# EAGLE design MusicalChristmasTree (EAGLE 7.5.0)
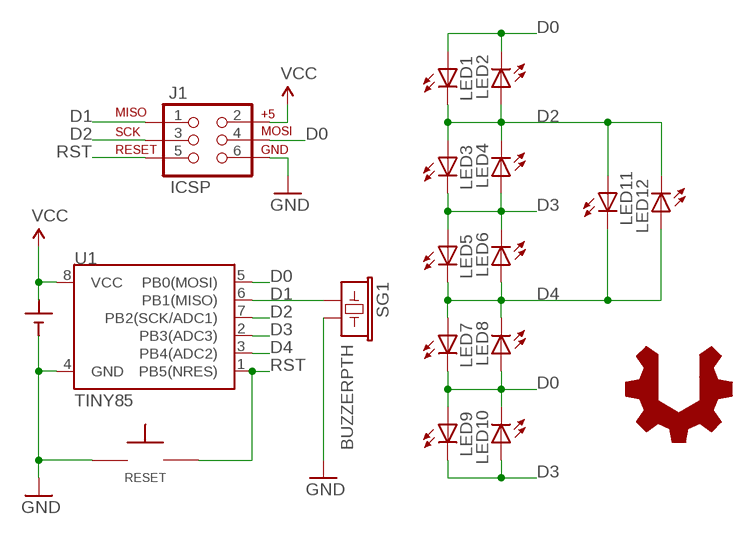
[diagram p0: schematic, sheet 1]

## Parts
BATT  CR2032  BATTCR2032_THRU  [CR2032-THRU]
J1  ICSP  AVR_SPI_PRG_6LABELED  [2X3-NS]
LED1  LED5MM  [LED5MM]
LED2  LED5MM  [LED5MM]
LED3  LED5MM  [LED5MM]
LED4  LED5MM  [LED5MM]
LED5  LED5MM  [LED5MM]
LED6  LED5MM  [LED5MM]
LED7  LED5MM  [LED5MM]
LED8  LED5MM  [LED5MM]
LED9  LED5MM  [LED5MM]
LED10  LED5MM  [LED5MM]
LED11  LED5MM  [LED5MM]
LED12  LED5MM  [LED5MM]
RESET  TAC_SPST_NO  [TAC_SPST_NO]
SG1  BUZZERPTH  [BUZZER-12MM]
U1  TINY85  ATTINY45TINY85-20-DIP  [DIP08]
U$1  USER_HACKABLE  [USER_HACKABLE]

## Nets
D0: J1.4(MOSI) LED1.A LED2.K(C) LED7.K(C) LED8.A LED9.A LED10.K(C) U1.5(PB0(MOSI))
D1: J1.1(MISO) SG1.+ U1.6(PB1(MISO))
D2: J1.3(SCK) LED1.K(C) LED2.A LED3.A LED4.K(C) LED11.A LED12.K(C) U1.7(PB2(SCK/ADC1))
D3: LED3.K(C) LED4.A LED5.A LED6.K(C) LED9.K(C) LED10.A U1.2(PB3(ADC3))
D4: LED5.K(C) LED6.A LED7.A LED8.K(C) LED11.K(C) LED12.A U1.3(PB4(ADC2))
GND: BATT.- J1.6(GND) RESET.P$1 SG1.- U1.4(GND)
RST: J1.5(RST) RESET.P$2 U1.1(PB5(NRES))
VCC: BATT.+1(+) J1.2(V+) U1.8(VCC)

## Library data of the parts
BATT = battery:BATT
J1 = barbary_enterprises:AVR_SPI_PRG_6: AVR ISP 6 Pin This is the reduced ISP connector for AVR programming. Common on Arduino. This footprint will take up less PCB space and can be used with a 10-pin to 6-pin adapter such as SKU: BOB-08508
LED1-LED12 = barbary_enterprises:LED: LEDs Standard schematic elements and footprints for 5mm, 3mm, 1206, and 0603 sized LEDs. 5mm - Spark Fun Electronics SKU : COM-00529 (and others)
RESET = barbary_enterprises:TAC_SPST_NO: 3,5 mm Tact Switches C&K PTS635 Series * Digi-Key Part Number: CKN9102-ND
SG1 = SparkFun-Electromechanical:BUZZER: Buzzer 12mm Spark Fun Electronics SKU : Comp-Buzzer
U1 = SparkFun-DigitalIC:ATTINY45: Atmel 8-pin 2/4/8kB flash uC; PROD_ID: IC-09445; VALUE: TINY85-20-DIP
U$1 = logo:USER_HACKABLE

## Board
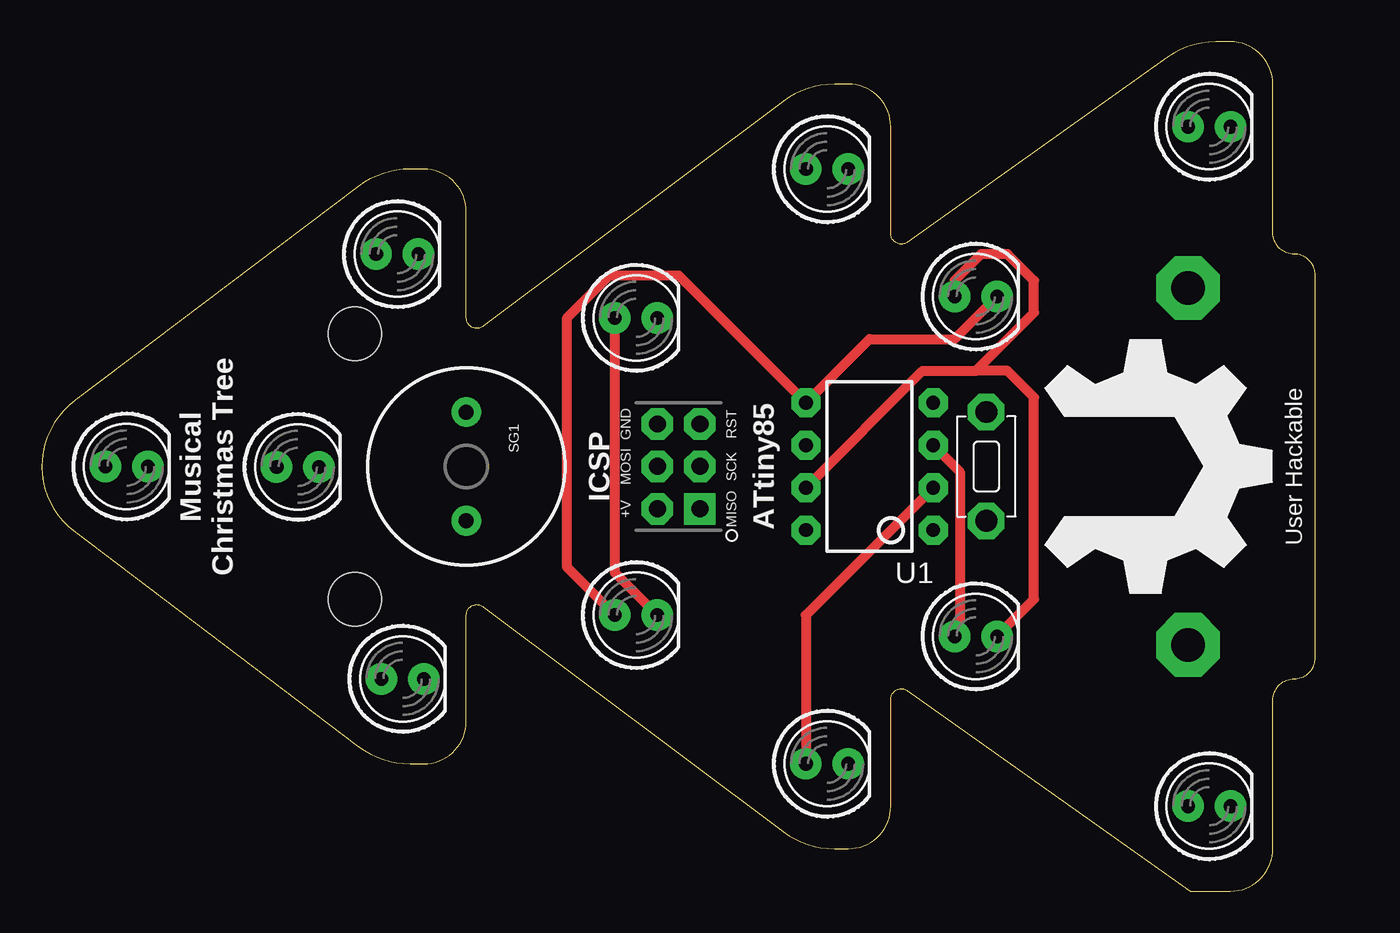
[diagram p1: board, top side]
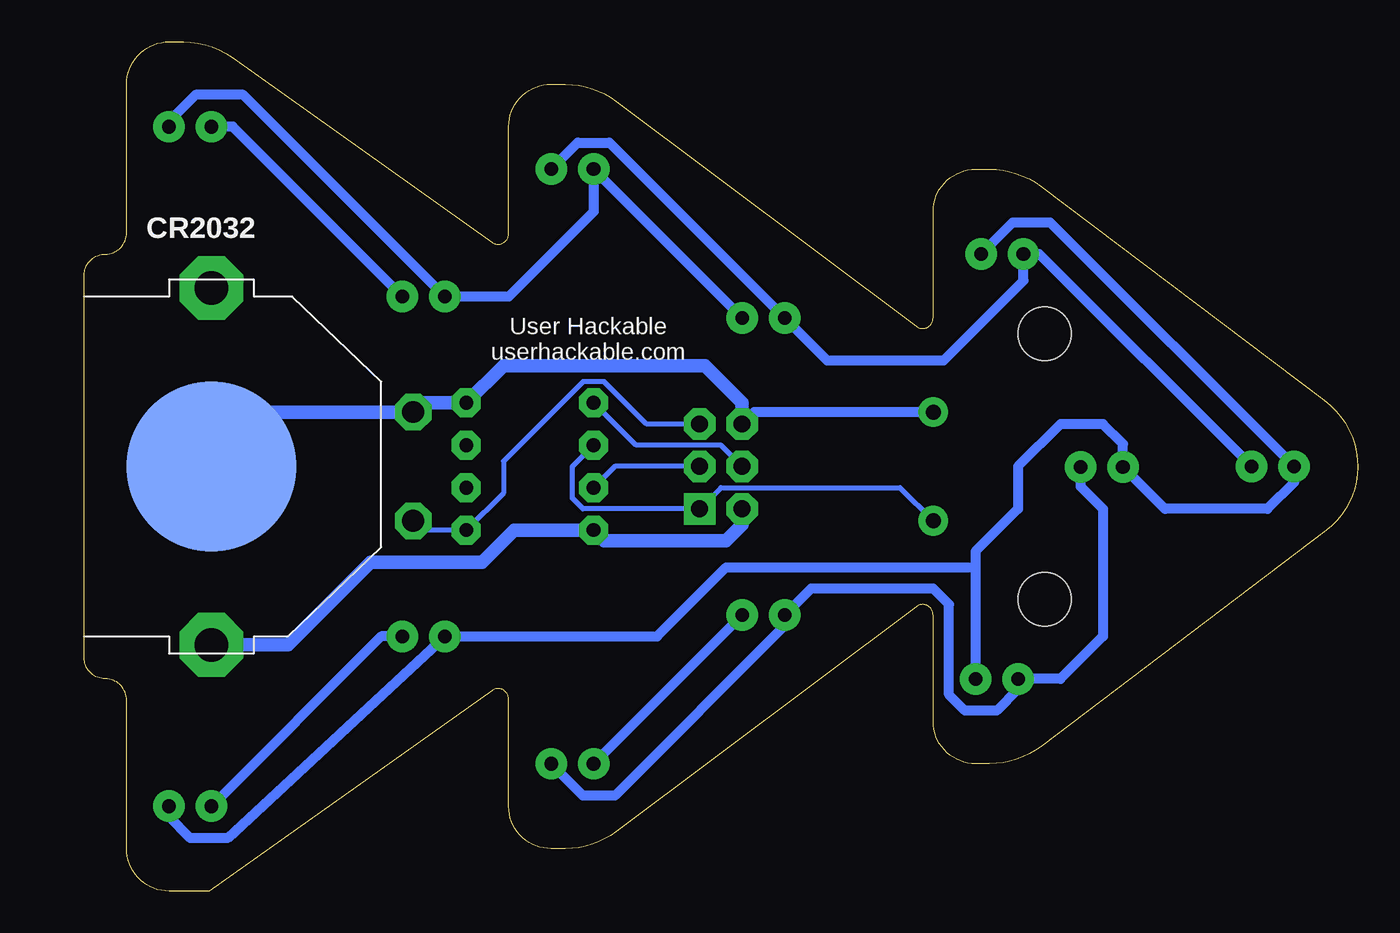
[diagram p2: board, bottom side, seen from below]

Size 76.2 x 50.8 mm. Coordinates in mm from the lower left corner, seen from the top.
Outline: 18.96,42.16 1.99,29.36 arc53 0,25.37 arc53 1.89,21.57 18.96,8.65 arc37 22.03,7.62 22.86,7.62 arc90 25.4,10.16 25.4,16.51 arc-127 26.42,17.02 44.37,3.56 arc37 47.41,2.54 48.26,2.54 arc90 50.8,5.08 50.8,11.47 arc-125 51.8,11.99 68.72,0 71.12,0 arc90 73.66,2.54 73.66,11.43 arc-90 74.93,12.7 arc90 76.2,13.97 76.2,36.83 arc90 74.93,38.1 arc-90 73.66,39.37 73.66,48.26 arc90 71.12,50.8 70.26,50.8 arc35 67.36,49.88 51.8,38.81 arc-125 50.8,39.33 50.8,45.72 arc90 48.26,48.26 47.41,48.26 arc37 44.37,47.24 26.42,33.78 arc-127 25.4,34.29 25.4,40.64 arc90 22.86,43.18 22.02,43.18 arc37 18.96,42.16
Copper layers (1*16): Top 0.0356mm / dielectric 1.5011mm / Bottom 0.0356mm
Design rules "LaenPCBOrder": minimum track width 6mil, minimum drill 13mil, track to track 6mil, track to pad 6mil, pad to pad 6mil, via to via 6mil, smd to smd 6mil, copper to edge 15mil, drill to drill 6mil, minimum pad ring 7mil, minimum via ring 7mil, stop-mask expansion 3mil, vias tented up to drill 0mil, thermal gap 10mil
Holes 3.17 mm at 18.73,33.34 18.73,17.46

### Footprints (pad centres in the part's own frame; a part is rotated, then mirrored left to right if it is on the bottom)
CR2032-THRU = drill 2 pad 3.81 octagon: +1 -10.668,0; +2 10.668,0 | smd 10.16 x 10.16: - 0,0
2X3-NS = drill 1.016 pad 1.88 square: 1 -2.54,-1.27 | drill 1.016 pad 1.88 octagon: 2 -2.54,1.27; 3 0,-1.27; 4 0,1.27; 5 2.54,-1.27; 6 2.54,1.27
LED5MM = drill 0.813 pad 1.88: A -1.27,0; K 1.27,0
TAC_SPST_NO = drill 1.3 pad 2.184 octagon: P$1 -3.251,0; P$2 3.251,0
BUZZER-12MM = drill 0.9 pad 1.778: + 3.25,0; - -3.25,0
DIP08 = drill 0.813 pad 1.727 octagon: 1 -3.81,-3.81; 2 -1.27,-3.81; 3 1.27,-3.81; 4 3.81,-3.81; 5 3.81,3.81; 6 1.27,3.81; 7 -1.27,3.81; 8 -3.81,3.81

### Placement (x,y rotation side)
BATT  68.58,25.4 90 bottom
J1  38.1,25.4 90 top
LED1  69.85,45.72 0 top
LED2  55.88,35.56 0 top
LED3  46.99,43.18 0 top
LED4  35.56,34.29 0 top
LED5  21.27,38.1 0 top
LED6  5.08,25.4 0 top
LED7  15.32,25.38 0 top
LED8  21.59,12.7 0 top
LED9  35.56,16.51 0 top
LED10  46.99,7.62 0 top
LED11  69.85,5.08 0 top
LED12  55.88,15.24 0 top
RESET  56.52,25.4 270 top
SG1  25.4,25.4 270 top
U1  49.53,25.4 90 top
U$1  66.04,25.4 90 top

### Tracks (layer width: path | path; a pad name or v marks a point on that pad's centre or on a via)
D0
  Top 0.61: LED2.K 54.61,33.02 49.53,33.02 U1.5 38.1,36.83 33.97,36.83 31.43,34.29 31.43,19.37 LED9.A
  Bottom 0.305: J1.4 38.1,26.67 43.18,26.67 U1.5
  Bottom 0.61: LED2.K 67.31,45.72 LED1.A | LED7.K 16.59,24.21 15.24,22.86 15.24,15.24 17.78,12.7 LED8.A 20.32,12.06 21.59,10.79 23.5,10.79 24.45,11.75 24.45,17.14 25.4,18.1 32.7,18.1 LED9.A 34.29,15.88 44.45,5.71 46.35,5.71 LED10.K
D1
  Bottom 0.305: U1.6 46.99,25.4 46.99,23.5 46.35,22.86 J1.1 38.1,24.13 27.38,24.13 SG1.+
D2
  Top 0.61: U1.7 52.7,31.11 55.56,31.11 55.88,31.11 | 55.88,31.11 59.37,34.61 59.37,36.51 57.78,38.1 56.2,38.1 54.61,36.51 LED2.A | LED12.K 59.37,17.46 59.37,29.53 57.78,31.11 55.88,31.11
  Bottom 0.305: J1.3 44.45,25.4 U1.7
  Bottom 0.61: LED1.K 71.12,46.04 69.53,47.62 66.67,47.62 LED2.A 50.8,35.56 45.72,40.64 LED3.A LED4.K | LED12.K 58.42,15.24 LED11.A
D3
  Top 0.61: U1.2 45.72,16.51 LED10.A | LED9.K 34.29,19.05 LED4.A
  Bottom 0.61: LED3.K 46.67,44.77 44.77,44.77 LED4.A 31.75,31.75 24.77,31.75 20,36.51 LED5.A 19.05,38.1 LED6.K | LED10.A LED9.K
D4
  Top 0.61: U1.3 54.93,25.08 54.93,16.19 LED12.A
  Bottom 0.61: LED5.K 20.64,40.01 18.41,40.01 LED6.A 3.81,24.45 5.4,22.86 11.54,22.86 LED7.A 14.05,26.75 15.24,27.94 17.78,27.94 20.32,25.4 20.32,22.86 22.86,20.32 22.86,19.37 | 22.86,19.37 LED8.K | LED11.K 71.12,4.45 69.85,3.17 67.63,3.17 LED12.A 41.91,15.24 37.78,19.37 22.86,19.37
GND
  Bottom 0.61: SG1.- 36.12,28.65 J1.6
  Bottom 0.813: BATT.- 66.6,28.65 RESET.P$1 56.59,29.21 U1.4 51.12,31.43 39.05,31.43 36.83,29.21 J1.6
RST
  Bottom 0.305: RESET.P$2 56.59,21.59 U1.1 51.12,23.81 51.12,25.72 46.35,30.48 45.09,30.48 42.55,27.94 J1.5
VCC
  Bottom 0.813: BATT.+1 64.01,14.73 59.05,19.68 52.39,19.68 50.48,21.59 U1.8 45.09,20.95 37.78,20.95 36.83,21.91 J1.2

### Text on the board
tPlace: Musical / Christmas Tree | ICSP | ATtiny85 | User Hackable
bPlace: CR2032 | User Hackable / userhackable.com